# Altium schematic sheet Interface_USART.SchDoc
size 38 x 12 mm
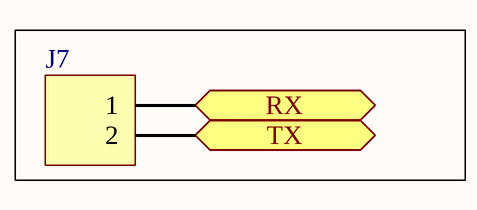
[diagram p0: Interface_USART.SchDoc]

## Parts
J7  2PIN  [HDR1X2]  (value not drawn)

## Ports
RX, TX

## Nets
RX: J7.1 ; port RX
TX: J7.2 ; port TX

## Library data of the parts
J7 = Header 2: Header, 2-Pin; Manufacturer: Generic Components; Class I: Connector; Revision: July-2002: Re-released for DXP Platform.; Publisher: Altium Limited